# EAGLE design OpenEVSE_PLUS_v5.5 (EAGLE 9.6.2)
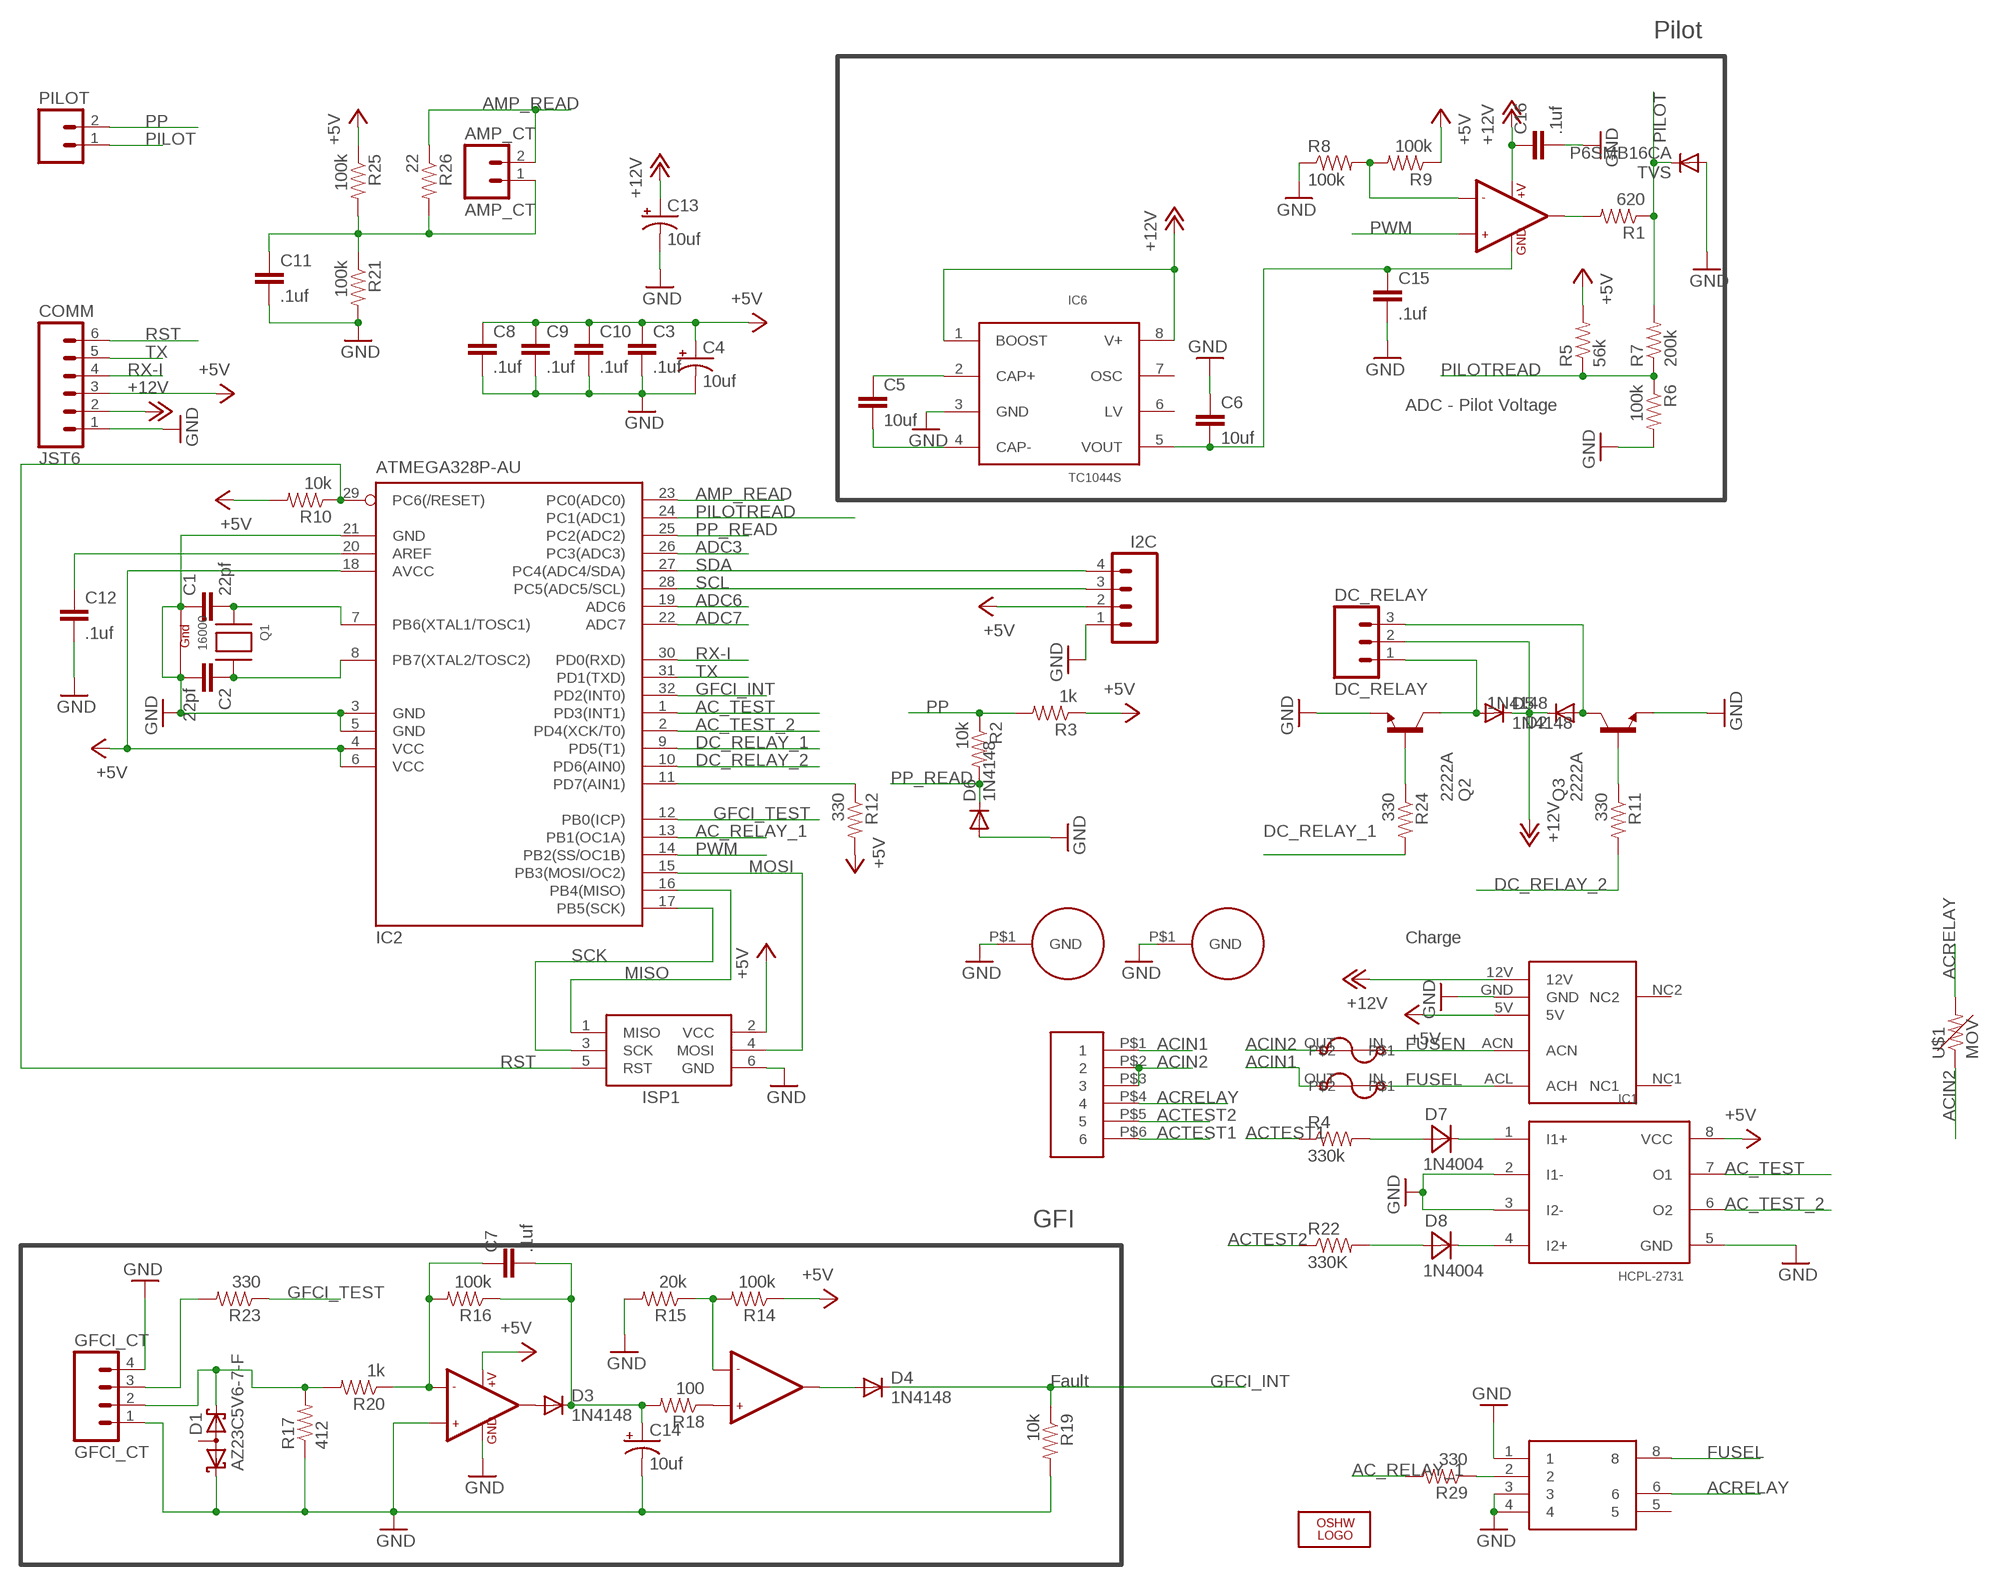
[diagram p0: schematic, sheet 1]

## Parts
AC  JST-VH-6  [JST-VH-6]
AMP_CT  AMP_CT  MOLEX_2  [MOLEX_2]
C1  22pf  CAP0805  [0805]
C2  22pf  CAP0805  [0805]
C3  .1uf  CAP0805  [0805]
C4  10uf  CAP_POL1206  [EIA3216]
C5  10uf  1.0UF50V10%(1206)  [1206-CAP]
C6  10uf  1.0UF50V10%(1206)  [1206-CAP]
C7  .1uf  CAP0805  [0805]
C8  .1uf  CAP0805  [0805]
C9  .1uf  CAP0805  [0805]
C10  .1uf  CAP0805  [0805]
C11  .1uf  CAP0805  [0805]
C12  .1uf  CAP0805  [0805]
C13  10uf  CAP_POL1206  [EIA3216]
C14  10uf  CAP_POL1206  [EIA3216]
C15  .1uf  CAP0805  [0805]
C16  .1uf  CAP0805  [0805]
COMM  JST6  [JST6]
D1  AZ23C5V6-7-F  BAS40-06  [SOT23]
D2  1N4148  DIODE-SOD123  [SOD123]
D3  1N4148  DIODE-SOD123  [SOD123]
D4  1N4148  DIODE-SOD123  [SOD123]
D5  1N4148  DIODE-SOD123  [SOD123]
D6  1N4148  DIODE-SOD123  [SOD123]
D7  1N4004  MBRA340T3  [SMA]
D8  1N4004  MBRA340T3  [SMA]
DC_RELAY  DC_RELAY  MOLEX_3  [MOLEX_3]
F1  BEL1AFUSE  [BELFUSE1A]
F2  BEL1AFUSE  [BELFUSE1A]
GFCI_CT  GFCI_CT  GFCI_4  [GFCI_4]
I2C  M04JST-PTH-VERT  [JST-4-PTH-VERT]
IC1  HCPL-2731  [DIP08]
IC2  ATMEGA328P-AU  MEGA8-AI  [TQFP32-08]
IC3  LM358  LMV358  [SO08]
IC4  LF353  LMV358  [SO08]
IC5  AQH1213  [DIP7]
IC6  TC1044S  [SO-8]
ISP1  AVRISP-6  [AVRISP]
LOGO1  OSHW_LOGO_8MILX0150-NT  [OSHW_8X150_NOTEXT]
PILOT  M025MM  [SCREWTERMINAL-5MM-2]
PS1  MPM-04E-1205  [MPM-04E-1205]
Q1  16000  XTAL-4-3225  [NX3225]
Q2  2222A  BCX70SMD  [SOT23]
Q3  2222A  BCX70SMD  [SOT23]
R1  620  RESISTOR0805-RES  [0805]
R2  10k  RESISTOR0805-RES  [0805]
R3  1k  RESISTOR0805-RES  [0805]
R4  330k  RESISTORPTH-1/4W  [AXIAL-0.4]
R5  56k  RESISTOR0805-RES  [0805]
R6  100k  RESISTOR0805-RES  [0805]
R7  200k  RESISTOR0805-RES  [0805]
R8  100k  RESISTOR0805-RES  [0805]
R9  100k  RESISTOR0805-RES  [0805]
R10  10k  RESISTOR0805-RES  [0805]
R11  330  RESISTOR0805-RES  [0805]
R12  330  RESISTOR0805-RES  [0805]
R14  100k  RESISTOR0805-RES  [0805]
R15  20k  RESISTOR0805-RES  [0805]
R16  100k  RESISTOR0805-RES  [0805]
R17  412  RESISTOR0805-RES  [0805]
R18  100  RESISTOR0805-RES  [0805]
R19  10k  RESISTOR0805-RES  [0805]
R20  1k  RESISTOR0805-RES  [0805]
R21  100k  RESISTOR0805-RES  [0805]
R22  330K  RESISTORPTH-1/4W  [AXIAL-0.4]
R23  330  RESISTOR0805-RES  [0805]
R24  330  RESISTOR0805-RES  [0805]
R25  100k  RESISTOR0805-RES  [0805]
R26  22  RESISTOR0805-RES  [0805]
R29  330  RESISTOR0805-RES  [0805]
TVS  P6SMB16CA  DIODE-SMB  [SMB]
U$1  MOV  [MOV]
U$3  HOLE  [HOLE]
U$4  HOLE  [HOLE]

## Nets
+5V: C3.1 C4.A(+) C8.1 C9.1 C10.1 COMM.3 I2C.2 IC1.8(VCC) IC2.4(VCC) IC2.6(VCC) IC2.18(AVCC) IC3.8(+V) ISP1.2(VCC) PS1.5V R3.1 R5.2 R9.1 R10.2 R12.2 R14.1 R25.1
+12V: C13.A(+) C16.1 COMM.2 D2.C D5.C DC_RELAY.2 IC4.8(+V) IC6.1(BOOST) IC6.8(V+) PS1.12V
-12V: C6.2 C15.1 IC4.4(GND) IC6.5(VOUT)
AC_RELAY_1: IC2.13(PB1(OC1A)) R29.2
AC_TEST: IC1.7(O1) IC2.1(PD3(INT1))
AC_TEST_2: IC1.6(O2) IC2.2(PD4(XCK/T0))
ACIN1: AC.P$1 F2.OUT
ACIN2: AC.P$2 AC.P$3 F1.OUT U$1.P$1
ACRELAY: AC.P$4 IC5.6 U$1.P$2
ACTEST1: AC.P$6 R4.P$1
ACTEST2: AC.P$5 R22.P$1
ADC3: IC2.26(PC3(ADC3))
ADC6: IC2.19(ADC6)
ADC7: IC2.22(ADC7)
AMP_READ: AMP_CT.2 IC2.23(PC0(ADC0)) R26.1
DC_RELAY_1: IC2.9(PD5(T1)) R24.2
DC_RELAY_2: IC2.10(PD6(AIN0)) R11.2
FUSEL: F2.IN IC5.8 PS1.ACL(ACH)
FUSEN: F1.IN PS1.ACN
GFCI_INT: D4.C IC2.32(PD2(INT0)) R19.1
GFCI_TEST: IC2.12(PB0(ICP)) R23.1
GND: C1.1 C2.2 C3.2 C4.C(-) C6.1 C8.2 C9.2 C10.2 C11.2 C12.2 C13.C(-) C14.C(-) C15.2 C16.2 COMM.1 D1.1(K1) D6.A GFCI_CT.1 GFCI_CT.4 I2C.1 IC1.2(I1-) IC1.3(I2-) IC1.5(GND) IC2.3(GND) IC2.5(GND) IC2.21(GND) IC3.3(+IN1) IC3.4(GND) IC5.1 IC5.3 IC5.4 IC6.3(GND) ISP1.6(GND) PS1.GND Q1.1(G1) Q1.3(G2) Q2.2(E) Q3.2(E) R6.2 R8.1 R15.2 R17.1 R19.2 R21.2 TVS.A U$3.P$1(GND) U$4.P$1(GND)
MISO: IC2.16(PB4(MISO)) ISP1.1(MISO)
MOSI: IC2.15(PB3(MOSI/OC2)) ISP1.4(MOSI)
N$1: D2.A DC_RELAY.3 Q3.3(C)
N$2: Q3.1(B) R11.1
N$4: C1.2 IC2.7(PB6(XTAL1/TOSC1)) Q1.2(X1)
N$5: C2.1 IC2.8(PB7(XTAL2/TOSC2)) Q1.4(X2)
N$6: D5.A DC_RELAY.1 Q2.3(C)
N$7: AMP_CT.1 C11.1 R21.1 R25.2 R26.2
N$8: C7.1 IC3.2(-IN1) R16.2 R20.1
N$9: D7.A R4.P$2
N$10: IC4.2(-IN1) R8.2 R9.2
N$11: IC4.1(OUT1) R1.2
N$12: D7.C IC1.1(I1+)
N$13: D8.C IC1.4(I2+)
N$17: D8.A R22.P$2
N$18: IC5.2 R29.1
N$19: C5.1 IC6.2(CAP+)
N$20: D1.2(K2) GFCI_CT.2 R17.2 R20.2
N$21: D3.A IC3.1(OUT1)
N$22: GFCI_CT.3 R23.2
N$23: C7.2 C14.A(+) D3.C R16.1 R18.2
N$24: IC3.6(-IN2) R14.2 R15.1
N$25: D4.A IC3.7(OUT2)
N$26: IC3.5(+IN2) R18.1
N$27: C5.2 IC6.4(CAP-)
N$28: IC2.11(PD7(AIN1)) R12.1
N$30: Q2.1(B) R24.1
N$44: C12.1 IC2.20(AREF)
PILOT: PILOT.1 R1.1 R7.2 TVS.C
PILOTREAD: IC2.24(PC1(ADC1)) R5.1 R6.1 R7.1
PP: PILOT.2 R2.1 R3.2
PP_READ: D6.C IC2.25(PC2(ADC2)) R2.2
PWM: IC2.14(PB2(SS/OC1B)) IC4.3(+IN1)
RST: COMM.6 IC2.29(PC6(/RESET)) ISP1.5(RST) R10.1
RX-I: COMM.4 IC2.30(PD0(RXD))
SCK: IC2.17(PB5(SCK)) ISP1.3(SCK)
SCL: I2C.3 IC2.28(PC5(ADC5/SCL))
SDA: I2C.4 IC2.27(PC4(ADC4/SDA))
TX: COMM.5 IC2.31(PD1(TXD))
Unconnected: D1.3(AA) IC4.5(+IN2) IC4.6(-IN2) IC4.7(OUT2) IC5.5 IC6.6(LV) IC6.7(OSC) PS1.NC1 PS1.NC2

## Notes on the sheet
- Pilot
- ADC - Pilot Voltage
- Charge
- GFI
- Fault

## Library data of the parts
AC = OpenEVSE:JST-VH-6
AMP_CT = OpenEVSE:MOLEX_2
C1-C3 C7-C12 C15 C16 = SparkFun:CAP: Capacitor Standard 0603 ceramic capacitor, and 0.1" leaded capacitor.
C4 C13 C14 = SparkFun:CAP_POL: Capacitor Polarized These are standard SMD and PTH capacitors. Normally 10uF, 47uF, and 100uF in electrolytic and tantalum varieties. Always verify the external diameter of the through hole cap, it varies with capacity, voltage, and manufacturer. The EIA devices should be standard.
C5 C6 = SparkFun-Capacitors:1.0UF50V10%(1206): CAP-09822
COMM = OpenEVSE:JST6
D1 = diode:BAS40-06: Silicon Schottky Diodes General-purpose diode for high-speed switching
D2-D6 TVS = diode:DIODE-: DIODE
D7 D8 = diode:MBRA340T3: Surface Mount Schottky Power Rectifier Source: http://www.onsemi.com/pub_link/Collateral/MBRA340T3-D.PDF
DC_RELAY = OpenEVSE:MOLEX_3
F1 F2 = Qxd:BEL1AFUSE
GFCI_CT = OpenEVSE:GFCI_4
I2C = SparkFun-Connectors:M04: Header 4 Standard 4-pin 0.1" header. Use with straight break away headers (SKU : PRT-00116), right angle break away headers (PRT-00553), swiss pins (PRT-00743), machine pins (PRT-00117), and female headers (PRT-00115). Molex polarized connector foot print use with SKU : PRT-08231 with associated crimp pins and housings. 1MM SMD Version SKU: PRT-10208
IC1 = Qxd:HCPL-2731
IC2 = atmel:MEGA8: MICROCONTROLLER 8 Kbytes FLASH, 1 kbytes SRAM, 512 bytes EEPROM, USART, 6-channel 10 bit ADC, 2-channel 8 bit ADC Pin compatible with Atmega48, ATMega88, ATMega168 Source: avr.lbr; MPN: ATMEGA8-16AU; OC_FARNELL: 9171371; OC_NEWARK: 73M8863
IC3 IC4 = SparkFun:LMV358
IC5 = SparkFun:AQH1213
IC6 = OpenEVSE:TC1044S
ISP1 = adafruit:AVRISP: AVR ISP HEADER Standard 6 pin header for AVR programming
LOGO1 = ohw-logo:OSHW_LOGO_8MIL
PILOT = SparkFun-Connectors:M02: Standard 2-pin 0.1" header. Use with - straight break away headers ( PRT-00116) - right angle break away headers (PRT-00553) - swiss pins (PRT-00743) - machine pins (PRT-00117) - female headers (PRT-00115) Molex polarized connector foot print use with: PRT-08233 with associated crimp pins and housings. 2.54_SCREWTERM for use with PRT-10571. 3.5mm Screw Terminal footprints for PRT-08084 5mm Screw Terminal footprints for use with PRT-08432; STOREFRONT_ID: PRT-08432
PS1 = Qxd:MPM-04E-1205
Q1 = adafruit:XTAL-4: Classic 4-pin 3.2 x 2.5mm crystal
Q2 Q3 = transistor-npn:BCX70*: NPN Transistor
R1-R12 R14-R26 R29 = SparkFun:RESISTOR: Resistor Basic schematic elements and footprints for 0603, 1206, and PTH resistors.
U$1 = OpenEVSE:MOV
U$3 U$4 = OpenEVSE:HOLE

## Board
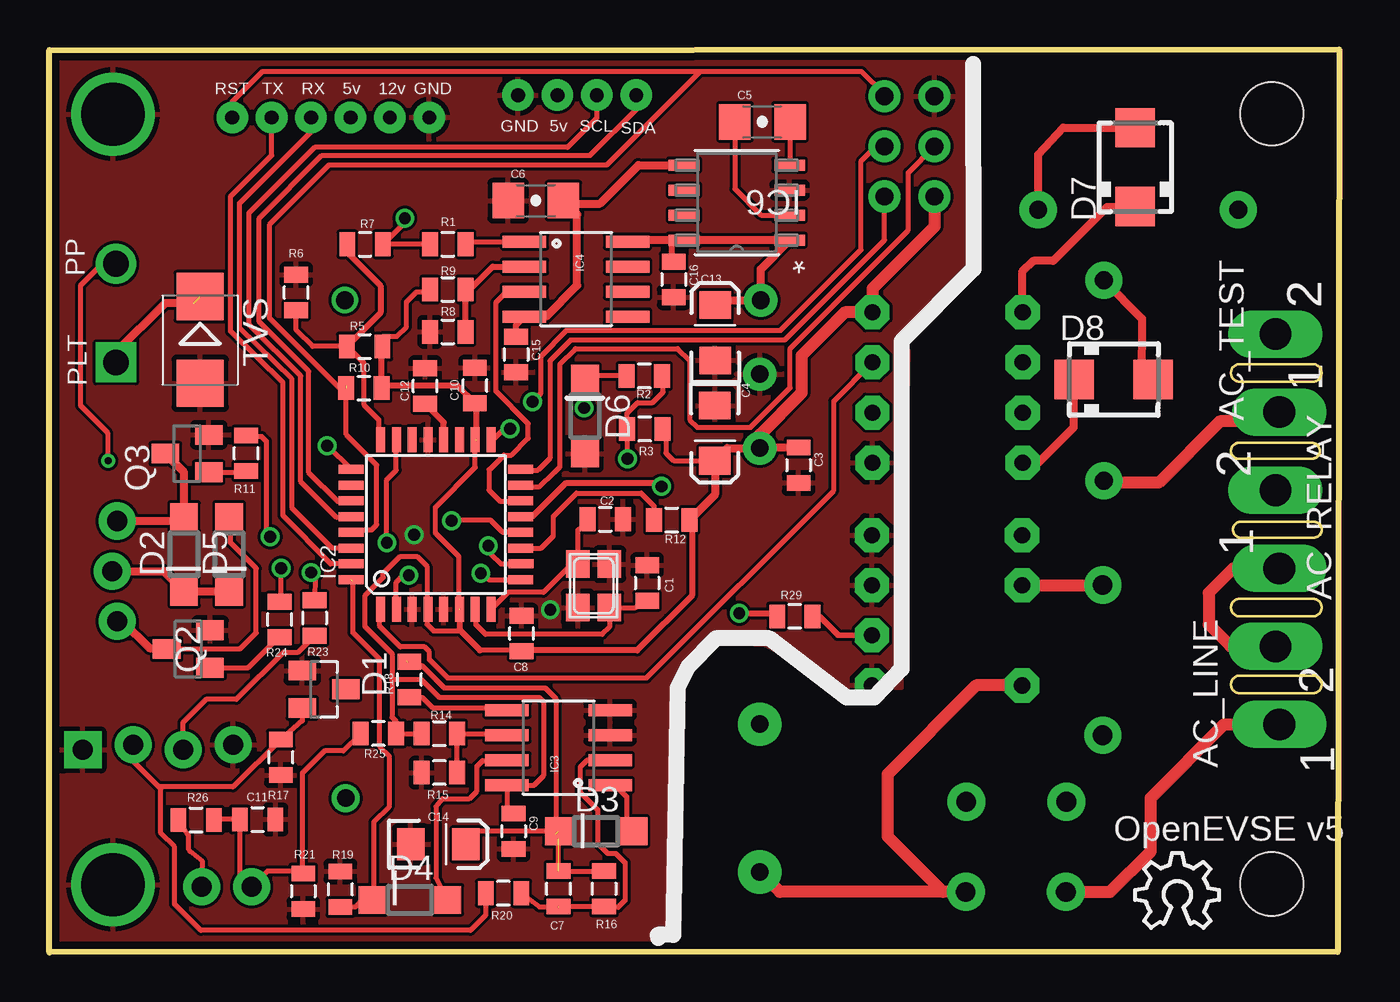
[diagram p1: board, top side]
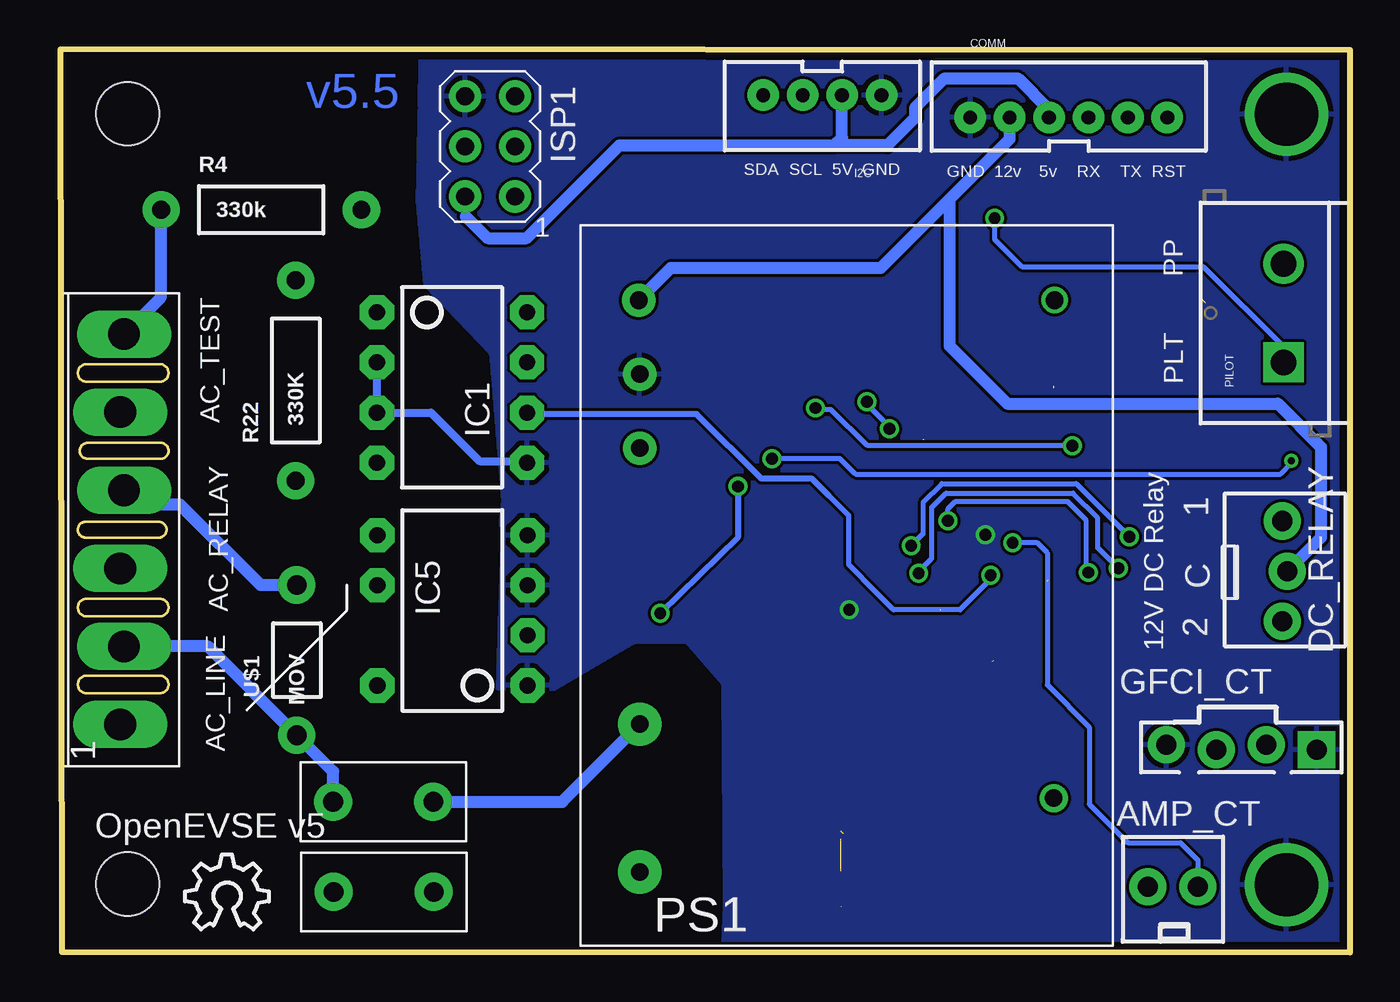
[diagram p2: board, bottom side, seen from below]

Size 65.45 x 45.8 mm. Coordinates in mm from the lower left corner, seen from the top.
Outline: 65.45,45.8 65.37,0.03 0,0 0,45.76 65.45,45.8
Copper layers (1*16): Top 0.0356mm / dielectric 1.5011mm / Bottom 0.0356mm
Design rules "default": minimum track width 6mil, minimum drill 13mil, track to track 6mil, track to pad 6mil, pad to pad 6mil, via to via 6mil, smd to smd 6mil, copper to edge 15mil, drill to drill 6mil, minimum pad ring 7mil, minimum via ring 7mil, stop-mask expansion 4mil, vias tented up to drill 0mil, thermal gap 10mil
Holes 3.2 mm at 62.03,42.53 62.04,3.47

### Footprints (pad centres in the part's own frame; a part is rotated, then mirrored left to right if it is on the bottom)
JST-VH-6 = drill 1.6 pad 1.93 long: P$1 0,11.88; P$2 -0.2,7.92; P$3 0,3.96; P$4 -0.2,0; P$5 0,-3.96; P$6 -0.2,-7.92
MOLEX_2 = drill 1.016 pad 1.88: 1 -1.27,0; 2 1.27,0
0805 = smd 0.8 x 1.2: 1 -0.9,0; 2 0.9,0
EIA3216 = smd 1.4 x 1.6: A 1.4,0; C -1.4,0
1206-CAP = smd 1.6 x 1.8: 1 -1.4,0; 2 1.4,0
JST6 = drill 0.7 pad 1.6: 1 -5,-0.28; 2 -3,-0.28; 3 -1,-0.28; 4 1,-0.28; 5 3,-0.28; 6 5,-0.28
SOT23 = smd 1 x 1.4: 1 -0.95,-1.1; 2 0.95,-1.1; 3 0,1.1
SOD123 = smd 1.4 x 1.4: A 1.9,0; C -1.9,0
SMA = smd 2 x 2: A 2,0; C -2,0
MOLEX_3 = drill 1.016 pad 1.88: 1 -2.54,0.127; 2 0,-0.127; 3 2.54,0.127
BELFUSE1A = drill 1 pad 1.93: IN 2,1.66; OUT 2,6.74
GFCI_4 = drill 1.016 pad 1.88 square: 1 0,0.127 | drill 1.016 pad 1.88: 2 2.54,-0.127; 3 5.08,0.127; 4 7.62,-0.127
JST-4-PTH-VERT = drill 0.7 pad 1.6: 1 -3,-0.55; 2 -1,-0.55; 3 1,-0.55; 4 3,-0.55
DIP08 = drill 0.813 pad 1.727 octagon: 1 -3.81,-3.81; 2 -1.27,-3.81; 3 1.27,-3.81; 4 3.81,-3.81; 5 3.81,3.81; 6 1.27,3.81; 7 -1.27,3.81; 8 -3.81,3.81
TQFP32-08 = smd 1.27 x 0.457: 1 -4.293,2.8; 2 -4.293,2; 3 -4.293,1.2; 4 -4.293,0.4; 5 -4.293,-0.4; 6 -4.293,-1.2; 7 -4.293,-2; 8 -4.293,-2.8; 17 4.293,-2.8; 18 4.293,-2; 19 4.293,-1.2; 20 4.293,-0.4; 21 4.293,0.4; 22 4.293,1.2; 23 4.293,2; 24 4.293,2.8 | smd 0.457 x 1.27: 9 -2.8,-4.293; 10 -2,-4.318; 11 -1.2,-4.293; 12 -0.4,-4.293; 13 0.4,-4.293; 14 1.2,-4.293; 15 2,-4.293; 16 2.8,-4.293; 25 2.8,4.293; 26 2,4.293; 27 1.2,4.293; 28 0.4,4.293; 29 -0.4,4.293; 30 -1.2,4.293; 31 -2,4.293; 32 -2.8,4.293
SO08 = smd 0.61 x 2.21: 1 -1.905,-2.616; 2 -0.635,-2.616; 3 0.635,-2.616; 4 1.905,-2.616; 5 1.905,2.616; 6 0.635,2.616; 7 -0.635,2.616; 8 -1.905,2.616
DIP7 = drill 0.813 pad 1.727 octagon: 1 -3.81,-3.81; 2 -1.27,-3.81; 3 1.27,-3.81; 4 3.81,-3.81; 5 3.81,3.81; 6 1.27,3.81; 8 -3.81,3.81
SO-8 = smd 1.549 x 0.559: 1 -2.68,1.905; 2 -2.68,0.635; 3 -2.68,-0.635; 4 -2.68,-1.905; 5 2.68,-1.905; 6 2.68,-0.635; 7 2.68,0.635; 8 2.68,1.905
AVRISP = drill 0.9 pad 1.626: 1 -1.27,2.54; 2 1.27,2.54; 3 -1.27,0; 4 1.27,0; 5 -1.27,-2.54; 6 1.27,-2.54
SCREWTERMINAL-5MM-2 = drill 1.3 pad 2.032 square: 1 0,0 | drill 1.3 pad 2.032: 2 5,0
MPM-04E-1205 = drill 0.9 pad 1.676: 5V 3,25.25; 12V 2.95,32.75; GND 3,29 | drill 0.9 pad 2.184: ACL 3,3.75; ACN 3,11.25 | drill 0.9 pad 1.422: NC1 24,7.5 | drill 0.9: NC2 24.05,32.75
NX3225 = smd 1.4 x 1.2: 1 -1.1,0.8; 2 1.1,0.8; 3 1.1,-0.8; 4 -1.1,-0.8
AXIAL-0.4 = drill 0.9 pad 1.88: P$1 -5.08,0; P$2 5.08,0
SMB = smd 2.4 x 2.4: A 2.2,0; C -2.2,0
MOV = drill 1 pad 1.88: P$1 -8.89,2.54; P$2 -1.27,2.54
HOLE = drill 3.2 pad 3.81: P$1 0,0

### Placement (x,y rotation side)
AC  62.41,23.44 180 bottom
AMP_CT  9,3.33 0 bottom
C1  30.33,18.74 270 top
C2  28.21,21.97 0 top
C3  38.02,24.71 270 top
C4  33.77,26.34 270 top
C5  36.18,42.13 0 top
C6  24.68,38.13 0 top
C7  25.84,3.22 90 top
C8  23.96,16.18 90 top
C9  23.55,6.15 270 top
C10  21.6,28.75 90 top
C11  10.57,6.74 0 top
C12  19.07,28.73 90 top
C13  33.78,31.43 90 top
C14  19.74,5.48 0 top
C15  23.68,30.33 270 top
C16  31.68,34.13 270 top
COMM  14.28,42.63 0 bottom
D1  13.94,13.34 270 top
D2  6.84,20.19 90 top
D3  27.74,6.15 0 top
D4  18.29,2.67 0 top
D5  9.13,20.19 90 top
D6  27.18,27.2 270 top
D7  55.1,39.83 90 top
D8  54.01,29.06 0 top
DC_RELAY  3.31,19.34 90 bottom
F1  44.86,5.64 90 bottom
F2  44.84,1.07 90 bottom
GFCI_CT  1.71,10.39 180 bottom
I2C  26.78,42.93 180 bottom
IC1  45.57,28.65 270 bottom
IC2  19.61,21.7 90 top
IC3  25.84,10.39 90 top
IC4  26.72,34.14 270 top
IC5  45.55,17.35 90 bottom
IC6  34.88,38.03 180 top
ISP1  43.64,40.88 180 bottom
LOGO1  55.1,1.24 0 top
LOGO2  OSHW_LOGO_8MILX0150-NT  [OSHW_8X150_NOTEXT]  59.11,1.17 0 bottom
PILOT  3.38,29.93 90 bottom
PS1  39.05,0.33 0 bottom
Q1  27.62,18.59 270 top
Q2  7.06,15.39 90 top
Q3  6.99,25.3 90 top
R1  20.22,35.91 0 top
R2  30.18,29.23 180 top
R3  30.21,26.54 180 top
R4  55.25,37.67 0 bottom
R5  16,30.73 0 top
R6  12.53,33.47 90 top
R7  16.03,35.91 0 top
R8  20.22,31.47 0 top
R9  20.22,33.63 0 top
R10  15.96,28.62 0 top
R11  9.99,25.32 90 top
R12  31.58,21.93 0 top
R14  19.79,11.1 0 top
R15  19.79,9.12 180 top
R16  28.15,3.22 270 top
R17  11.75,9.9 90 top
R18  18.27,13.84 90 top
R19  14.77,3.2 90 top
R20  23.04,3 180 top
R21  12.88,3.1 270 top
R22  53.5,29.01 90 bottom
R23  13.47,16.96 270 top
R24  11.69,16.88 90 top
R25  16.69,11.1 180 top
R26  7.45,6.72 0 top
R29  37.83,17.04 180 top
TVS  7.65,31.06 270 top
U$1  50.9,19.9 90 bottom
U$3  3.23,42.52 0 top
U$4  3.23,3.43 0 top

### Tracks (layer width: path | path; a pad name or v marks a point on that pad's centre or on a via)
+5V  (2 unrouted)
  Top 0.254: R5.2 16.93,31.24 17.63,31.24 18.12,31.72 18.12,32.99 18.62,33.5 19.39,33.5 19.39,33.56 R9.1 | 20.78,17.37 20.78,20.08 19.58,21.29 19.58,22.56 21.61,24.6 IC2.18 21.63,26.01 | C8.1 23.96,15.34 24.04,15.42 | 19.16,16.81 19.16,19.58 18.65,20.09 17.81,20.09 16.95,19.23 16.95,19.02 16.01,18.08 16.01,16.53 17.39,15.15 17.39,13.83 | 19.16,16.81 19.16,16.64 19.49,16.3 20.81,16.3 20.83,16.33 | IC2.4 19.21,16.87 19.16,16.81 | R25.1 R14.1 | 17.61,11.11 R25.1 | C9.1 23.42,7.17 23.41,7.17 23.22,7.36 IC3.8 24.62,8.48 24.62,8.51 25.1,8.99 25.1,12.7 24.87,12.93 19.79,12.93 18.89,13.83 17.39,13.83 | 21.85,15.32 24.38,15.32 24.48,15.42 | R3.1 31.28,26.37 31.28,25.33 31.67,24.94 C4.A | R25.1 17.59,11.72 17.39,11.93 17.39,13.83
  Top 0.305: 20.85,17.36 IC2.6 20.83,17.38 20.83,16.33 21.85,15.32 | R5.2 16.86,31.02 R10.2 16.98,28.75 20.7,28.75 C10.1 21.67,27.77 21.67,26.01 | 24.38,15.32 29.82,15.32 32.63,18.12 32.63,21.78 R12.2 | 24.48,15.42 24.04,15.42
  Top 0.406: PS1.5V 35.98,26.01 | PS1.5V 34.41,25.58 C4.A 33.77,23.21 R12.2 | PS1.5V 36.08,25.61 C3.1
  Top 0.61: ISP1.2 44.91,36.81 41.76,33.66 IC1.8 40.36,32.46 38.17,30.26 38.17,28.39 36.05,26.26 PS1.5V
  Bottom 0.406: 44.89,38.31 44.88,37.33
  Bottom 0.61: 44.88,37.33 43.78,36.23 41.78,36.23 37.08,40.93 26.18,40.93 | ISP1.2 44.89,38.31 | 26.18,40.93 25.78,41.33 I2C.2 | COMM.3 15.28,42.75 16.86,44.33 20.58,44.33 22.08,42.83 22.08,42.33 23.48,40.93 26.18,40.93
+12V
  Top 0.305: C16.1 31.58,35.13 31.58,36.12
  Top 0.406: D5.C D2.C | 6.72,18.29 6.79,18.36 5.81,19.34 DC_RELAY.2 | IC4.8 29.41,36.12 31.58,36.12 IC6.8 IC6.1 36.1,34.66 PS1.12V 34.03,33.08 C13.A
  Top 0.61: D2.C 6.72,18.29
  Bottom 0.61: PS1.12V 34.46,34.71 23.82,34.71 20.33,38.2 | 20.33,38.2 20.33,30.76 17.4,27.83 3.68,27.83 1.48,25.63 1.48,21.04 DC_RELAY.2 | COMM.2 17.28,41.24 20.33,38.2
-12V
  Top 0.305: C15.1 23.68,31.82 IC4.4
  Top 0.406: IC4.4 25.2,32.24 26.78,33.83 26.78,37.43 C6.2 26.23,37.98 27.93,37.98 29.89,39.93 IC6.5
AC_RELAY_1  (via drill 0.6)
  Top 0.305: IC2.13 24.51,22.1 26.23,23.82 30.88,23.82 v31.06,23.63 | v35.01,17.19 36.77,17.19 R29.2
  Bottom 0.305: v31.06,23.63 31.06,21.05 v35.01,17.19
AC_TEST
  Top 0.254: IC2.1 16.77,17.37 16.77,16.53 17.81,15.49 19.03,15.49 19.29,15.24 19.29,14.83 20.2,13.92 30.3,13.92 39.8,23.41 39.8,27.96 IC1.7
AC_TEST_2  (via drill 0.6)
  Top 0.254: v18.24,19.12 17.86,19.02 17.58,18.74 17.58,17.43 IC2.2
  Bottom 0.254: 26.45,23.16 25.46,22.17 25.46,19.68 24.06,18.26 23.17,17.37 19.79,17.37 18.24,18.92 v18.24,19.12
  Bottom 0.305: 26.45,23.16 27.31,24.03 29.88,24.03 33.16,27.3 41.69,27.3 IC1.6
ACIN1
  Top 0.61: F2.OUT 53.82,3.06 55.88,5.13 55.88,7.83 59.61,11.56 AC.P$1
ACIN2
  Top 0.61: AC.P$3 60.07,19.48 58.82,18.23 58.82,16.64 59.94,15.52 AC.P$2
  Bottom 0.61: F1.OUT 51.6,9.17 U$1.P$1 57.95,15.52 AC.P$2
ACRELAY
  Top 0.61: IC5.6 53.43,18.62 U$1.P$2
  Bottom 0.61: AC.P$4 61.49,22.73 59.38,22.73 55.29,18.63 U$1.P$2
ACTEST1
  Bottom 0.61: AC.P$6 60.33,33.23 R4.P$1
ACTEST2
  Top 0.61: AC.P$5 61.93,26.93 59.38,26.93 56.28,23.83 53.6,23.83 R22.P$1
AMP_READ  (via drill 0.6)
  Top 0.254: v17.13,20.78 17.13,23.98 17.61,24.46 IC2.23 | R26.1 7.06,5.95 7.06,5.25 7.14,5.12 7.78,4.61 AMP_CT.2
  Bottom 0.254: v17.13,20.78 15.88,20.78 15.37,20.27 15.37,13.56 13.24,11.43 13.24,7.52 11.28,5.56 8.62,5.56 7.73,4.67 AMP_CT.2
DC_RELAY_1  (via drill 0.6)
  Top 0.254: R24.2 11.77,17.81 v11.77,19.48 | v21.89,19.22 21.99,19.22 22.31,18.9 IC2.9
  Bottom 0.254: v11.77,19.48 12.81,20.52 12.81,22.04 14.06,23.29 20.51,23.29 21.24,22.56 21.24,19.98 21.89,19.32 v21.89,19.22
DC_RELAY_2  (via drill 0.6)
  Top 0.254: v11.21,21.08 11.01,21.28 11.01,25.93 10.78,26.16 10.05,26.16 R11.2 | v22.28,20.62 22.39,20.51 22.39,20.22 22.91,19.7 IC2.10
  Bottom 0.254: v22.28,20.62 21.68,21.22 21.68,22.82 20.73,23.77 13.9,23.77 v11.21,21.08
FUSEL
  Top 0.61: F2.IN 45.35,3.06 | 45.35,3.06 37.06,3.06 PS1.ACL | IC5.8 47.02,13.54 42.53,9.04 42.53,5.89 45.35,3.06
FUSEN
  Bottom 0.61: F1.IN 39.99,7.64 PS1.ACN
GFCI_INT  (1 unrouted)
  Top 0.254: 15.4,18.82 15.4,16.23 16.77,14.86 16.77,10.44 17.23,9.98 17.23,7.37 16.47,6.6 16.47,3.32 D4.C 15.89,2.67 15.53,2.3 R19.1
GFCI_TEST  (via drill 0.6)
  Top 0.254: v13.29,19.27 13.48,19.08 R23.1 | IC2.12 23.01,21.3 22.38,21.93 20.43,21.93 v20.41,21.9
  Bottom 0.254: v20.41,21.9 20.41,22.5 20.02,22.88 14.34,22.88 13.42,21.96 13.42,19.4 v13.29,19.27
GND  (via drill 0.6)
  Bottom 0.406: IC1.2 IC1.3 46.64,27.38 44.18,24.92 41.84,24.92 IC1.5
  other vias: 18.52,21.18 25.42,17.38
  pour Bottom: -1.87,46.74 47.15,46.02 47.3,38.07 46.92,33.86 43.57,30.35 42.96,22.86 43.11,21.69 43.01,21.89 42.98,21.54 43.24,13.41 40.42,13.36 36.34,15.76 33.67,15.79 31.81,13.61 31.73,2.41 31.8,0.43 30.56,0.33 -1.59,-0.6
  pour Top: 0,45.42 23.16,47.07 46,46.9 46.99,44.65 47,34.62 43.31,30.94 43.31,30.81 43.57,30.53 43.21,13.41 40.29,13.33 39.91,13.61 36.33,15.59 33.84,15.7 31.8,13.74 31.8,-3.62 8.33,-2.22 -1.69,-2.86 0,29.17
MISO
  Top 0.254: IC2.16 23.94,24.46 24.8,24.46 25.41,25.07 25.41,30 26.47,31.06 37.32,31.06 42.38,36.13 42.38,38.32 ISP1.1
MOSI
  Top 0.254: IC2.15 24.01,23.59 24.85,23.59 25.61,24.33 25.89,24.61 25.89,29.82 26.7,30.63 31.88,30.63 32.48,30.03 32.48,27.03 32.88,26.63 35.58,26.63 37.58,28.63 37.58,30.63 43.58,36.63 43.58,39.55 ISP1.4
N$1
  Top 0.406: Q3.3 6.84,24.35 D2.A 6.63,21.88 DC_RELAY.3
N$2
  Top 0.254: Q3.1 9.92,24.35 R11.1
N$4
  Top 0.254: C1.2 29.73,17.49 Q1.2 28.42,16.5 28.05,16.13 22.13,16.13 21.65,16.61 21.65,17.37 IC2.7
N$5
  Top 0.254: C2.1 27.13,21.8 27.13,21.69 26.82,21.42 Q1.4 26.4,19.56 26.38,19.56 25.08,18.26 23.27,18.26 IC2.8
N$6
  Top 0.254: Q2.3 9.68,15.39 10.5,16.2 10.5,19.48 9.2,20.78 9.2,21.39 9.52,21.7
  Top 0.305: 9.52,21.7 D5.A
  Top 0.406: Q2.3 6,15.43 5.08,15.43 3.71,16.8 DC_RELAY.1
N$7
  Top 0.254: R25.2 14.92,10.22 13.96,10.22 12.83,9.09 12.83,4.05 R21.1 | R26.2 8.37,6.74 C11.1 9.67,4 AMP_CT.1 11.07,4.13 12.81,4.13
  Top 0.305: R21.1 12.88,4.05 12.81,4.13
N$8  (1 unrouted)
  Top 0.254: R16.2 C7.1 | 28.12,2.3 R16.2 | 25.82,2.31 24.87,2.31 23.91,3.02 R20.1 | IC3.2 27.29,9.75 26.93,9.4 26.93,8.13 27.82,7.24 27.82,5.54 28.33,5.03 28.74,5.03 29.22,4.55 29.22,2.64 28.86,2.28 28.19,2.28 R16.2
N$9
  Top 0.406: R4.P$2 50.17,40.46 51.44,41.83 54.03,41.83 D7.A
N$10
  Top 0.305: IC4.2 22.5,34.78 21.47,33.75 20.99,33.75 R9.2 R8.2
N$11
  Top 0.254: IC4.1 21.26,36.05 R1.2
N$12
  Top 0.406: D7.C 53.66,37.8 50.93,35.08 49.92,35.08 49.36,34.52 49.36,32.48 IC1.1
N$13
  Top 0.406: IC1.4 50.2,24.84 51.98,26.63 51.98,29.03 D8.C
N$17
  Top 0.406: R22.P$2 55.44,32.14 55.41,28.96 55.91,28.96 D8.A
N$18
  Top 0.305: R29.1 39.07,17.04 40.01,16.1 IC5.2
N$19
  Top 0.254: C5.1 34.78,38.73 36.12,37.39 IC6.2
N$20
  Top 0.254: 5.56,8.39 9.32,8.39 11.73,10.8 R17.2 12.84,11.75 D1.2 | R20.2 22.14,1.89 21.37,1.12 7.69,1.12 6.35,2.45 6.35,5.35 5.66,6.04 5.66,8.29 5.56,8.39 | GFCI_CT.2 4.25,9.7 5.56,8.39
N$21
  Top 0.254: IC3.1 28.71,8.48 29.29,7.9 29.29,6.5 D3.A
N$22
  Top 0.254: R23.2 12.63,15.22 11.88,15.22 9.49,12.83 7.95,12.83 6.79,11.67 GFCI_CT.3
N$23  (3 unrouted)
  Top 0.254: 28.38,4.11 28.38,3.99 28.24,4.12 R16.1 C7.2 25.84,6.02 25.71,6.15 21.27,6.15 21.14,6.02 C14.A | 25.84,5.77 D3.C | 25.72,6.02 25.71,6.02 25.71,12.86 25.16,13.41 20.02,13.41 18.9,14.53 18.48,14.53 R18.2 18.18,14.74 | 18.09,14.78 18.6,14.78
N$24
  Top 0.254: R15.1 R14.2 23.15,11.1 IC3.6
N$25
  Top 0.254: D4.A 19.62,3.78 19.62,7.39 19.95,7.8 21.32,7.8 21.7,8.18 21.7,9.45 21.98,9.73 23.2,9.73 IC3.7
N$26
  Top 0.254: IC3.5 23.09,12.42 19.44,12.42 18.93,12.93 18.28,12.93 R18.1
N$27
  Top 0.254: C5.2 37.58,39.95 IC6.4
N$28
  Top 0.254: IC2.11 24.95,20.5 25.58,21.13 25.58,22.13 26.74,23.29 30.02,23.29 30.68,22.63 R12.1
N$30
  Top 0.254: Q2.1 10.1,14.44 11.65,15.98 R24.1
N$44
  Top 0.305: IC2.20 20.01,26.88 C12.1
PILOT  (via drill 0.6)  (1 unrouted)
  Top 0.254: v18.04,37.23 18.04,37.03 R7.2 R1.1
  Top 0.406: 7.32,32.93 5.88,32.93 3.38,30.43 PILOT.1
  Bottom 0.254: v18.04,37.23 18.04,36.17 16.65,34.78 7.45,34.78 3.38,30.71 PILOT.1
PILOTREAD
  Top 0.254: R6.1 12.53,31.57 13.35,30.73 R5.1 15.96,29.9 15.96,27.79 16.72,27.02 16.72,25.88 16.85,25.88 16.85,25.96 IC2.24
  Top 0.305: R7.1 15.13,35.48 16.8,33.81 16.8,32.44 R5.1
PP  (via drill 0.35, 0.6)
  Top 0.254: v29.34,25.04 29.31,25.08 R3.2 29.31,27.34 29.85,27.89 30.61,27.89 31.15,28.42 31.15,29.17 R2.1 | v2.98,24.93 2.98,26.33 1.58,27.73 1.58,33.83 2.68,34.93 PILOT.2
  Bottom 0.254: v29.34,25.04 25.89,25.04 25.1,24.25 3.52,24.25 2.98,24.8 v2.98,24.93
PP_READ  (via drill 0.6)
  Top 0.254: R2.2 27.36,29.23 D6.C 27.13,29.3 v27.13,27.61 | IC2.25 15.33,24.47 v14.1,25.7
  Bottom 0.254: v14.1,25.7 24.49,25.7 26.35,27.53 27.06,27.53 v27.13,27.61
PWM
  Top 0.254: IC4.3 24.05,33.45 23.14,33.45 22.66,32.97 22.66,28.45 24.29,26.82 24.29,26.07 23.44,25.22 23.07,25.22 22.33,24.48 22.31,24.48 22.31,23.44 22.87,22.88 23.89,22.88 IC2.14
RST  (1 unrouted)
  Top 0.254: 15.07,28.53 15.07,26.26 16.62,24.71 16.62,21.69 16.34,21.41 15.43,21.41 IC2.29 | 15.07,28.53 15.07,28.73 | ISP1.5 42.37,43.51 41.21,44.67 10.8,44.67 | 15.07,28.53 14.81,28.53 11.16,32.18 11.16,36.9 14.18,39.93 28.28,39.93 33.02,44.67 10.8,44.67 | 10.8,44.67 9.28,43.15 COMM.6
RX-I
  Top 0.254: IC2.30 14.36,20.5 12.3,22.56 12.3,29.08 9.66,31.66 9.66,38 13.28,41.63 COMM.4
SCK  (via drill 0.6)
  Top 0.254: IC2.17 22.52,25.99 23.08,26.55 v23.38,26.55 | v24.52,27.92 24.92,28.32 24.92,30.22 26.24,31.54 37.1,31.54 41.18,35.63 41.18,40.13 41.93,40.88 ISP1.3
  Bottom 0.254: v24.52,27.92 24.52,27.8 23.38,26.66 v23.38,26.55
SCL
  Top 0.254: IC2.28 14.58,22.05 12.75,23.88 12.75,29.23 10.14,31.82 10.14,37.51 13.46,40.83 26.28,40.83 27.78,42.33 I2C.3
SDA
  Top 0.254: IC2.27 14.62,22.87 13.16,24.33 13.16,29.46 10.65,31.98 10.65,37.24 13.83,40.42 27.44,40.42 29.78,42.76 I2C.4
TX
  Top 0.254: IC2.31 14.27,19.7 11.87,22.15 11.87,28.9 9.2,31.5 9.2,38.35 11.28,40.43 COMM.5

### Text on the board
Bottom: v5.5
tPlace: RST | TX | RX | 5v | 12v | GND | GND | 5v | SCL | SDA
bPlace: RST | TX | RX | 5v | 12v | GND | GND | 5V | SCL | SDA
tNames: PP | 2 | PLT | 1 | AC_TEST | 2 | _ | _ | 1 | AC_RELAY | 2 | AC_LINE | 1 | _ | OpenEVSE v5 | _
bNames: PP | AC_TEST | PLT | AC_RELAY | 1 | C | 2 | AC_LINE | 12V DC Relay | OpenEVSE v5 | PS1